# EAGLE board alpha (EAGLE 6.4)
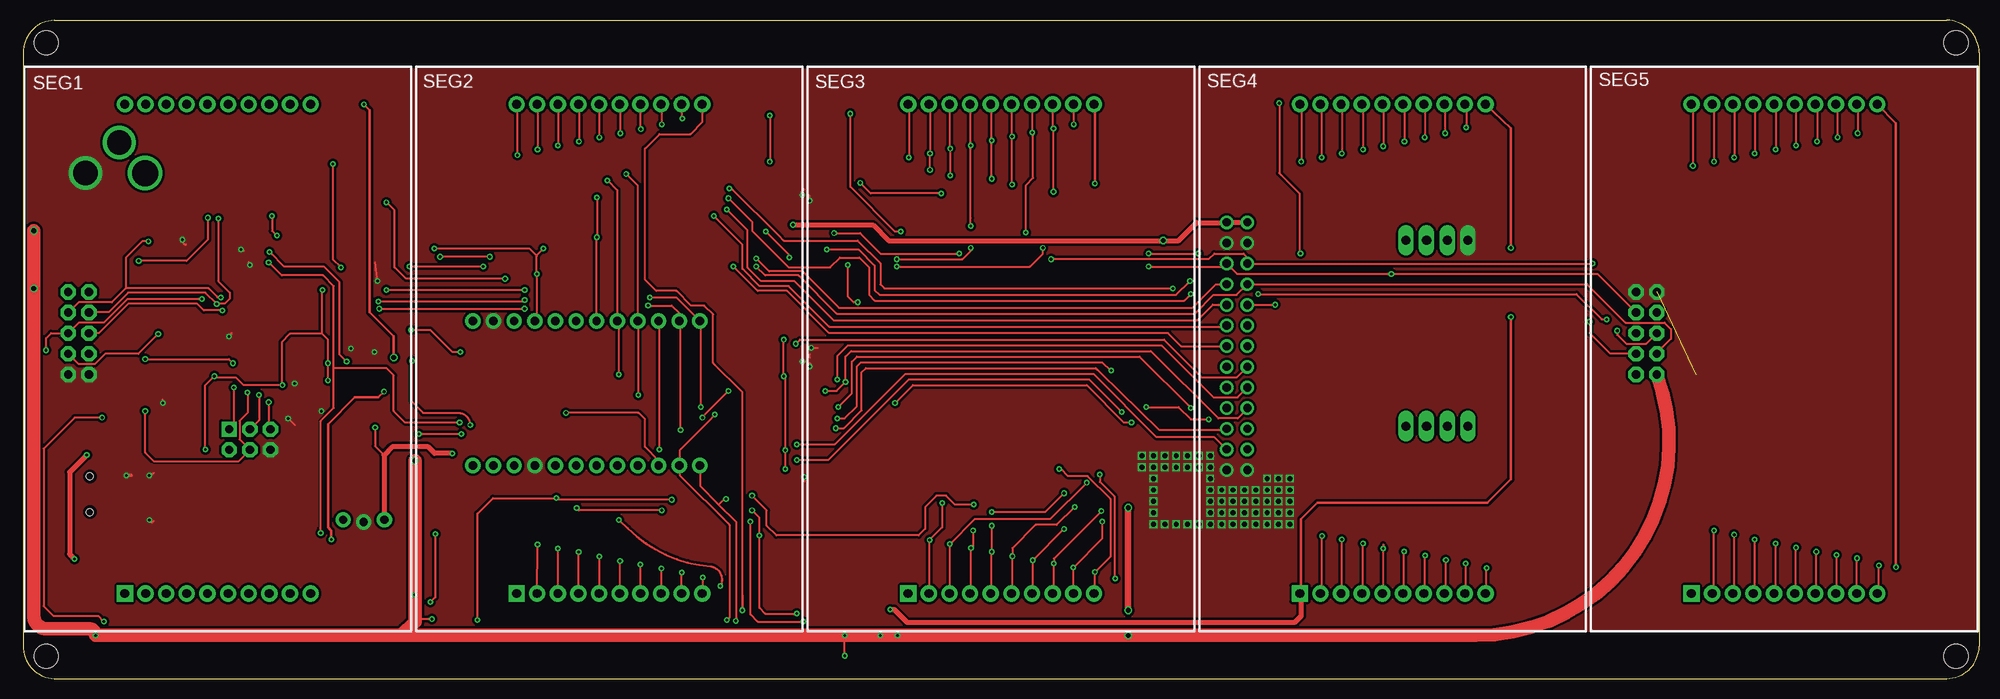
[diagram p1: board, top side]
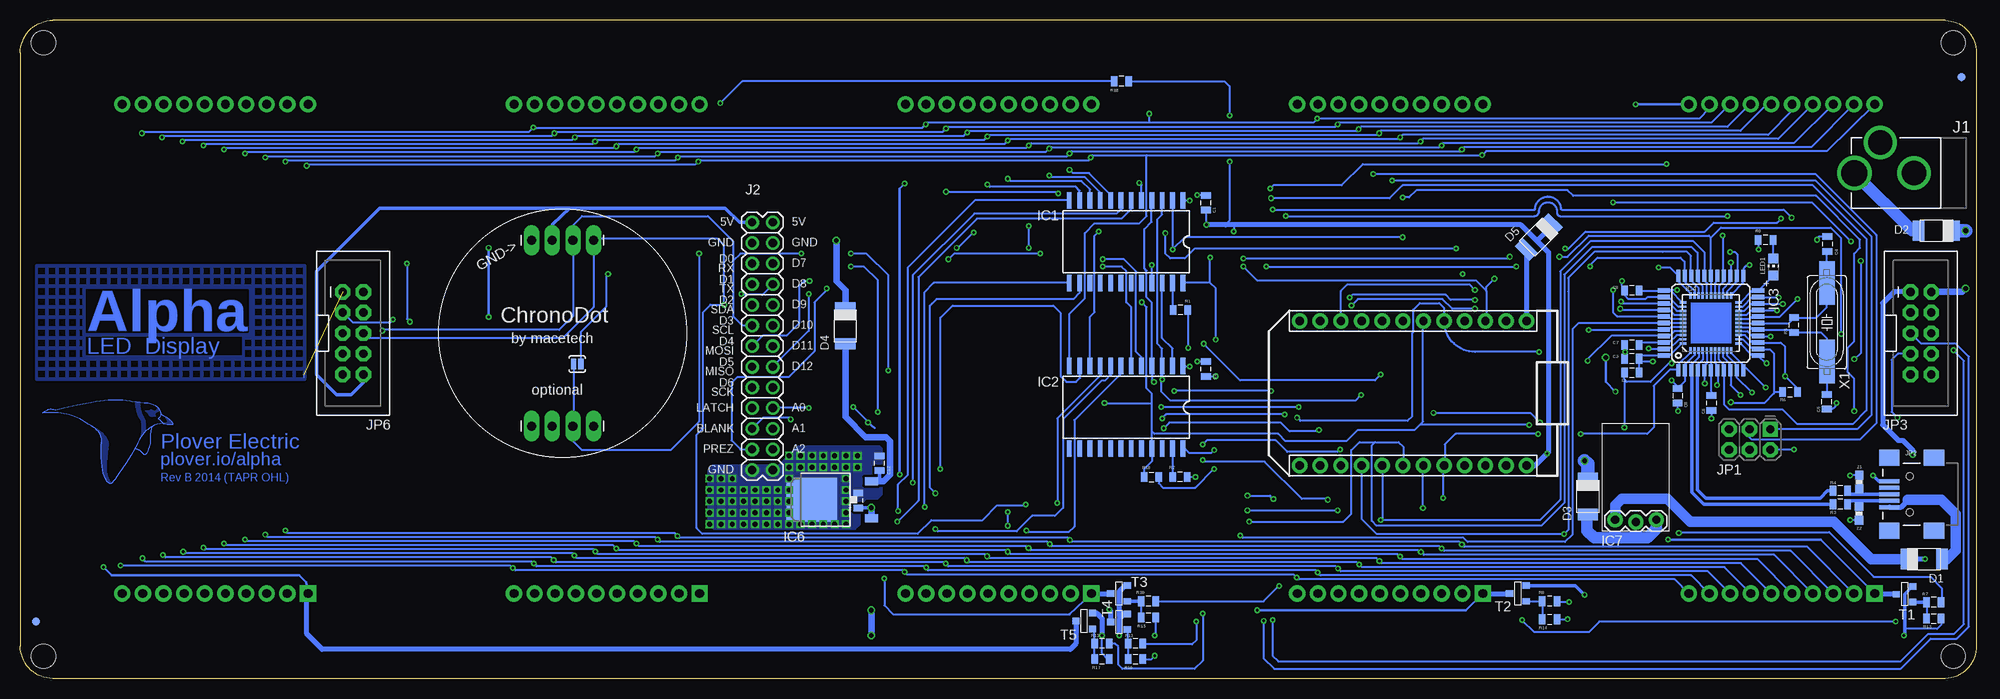
[diagram p2: board, bottom side, seen from below]

Size 240.75 x 81 mm. Coordinates in mm from the lower left corner, seen from the top.
Outline: 3.8,0 236.75,0 arc90 240.75,4 240.75,77 arc90 236.75,81 3.8,81 arc90 0,77 0,4 arc90 3.8,0
Copper layers (1*16): Top 0.0356mm / dielectric 1.5011mm / Bottom 0.0356mm
Design rules "OSHPark *": minimum track width 6mil, minimum drill 13mil, track to track 6mil, track to pad 6mil, pad to pad 6mil, via to via 6mil, smd to smd 6mil, copper to edge 15mil, drill to drill 6mil, minimum pad ring 7mil, minimum via ring 7mil, stop-mask expansion 3mil, vias tented up to drill 15mil, thermal gap 10mil
Holes 3 mm at 2.8,78.25 237.9,78.25 237.9,2.75 2.8,2.75

## Footprints (pad centres in the part's own frame; a part is rotated, then mirrored left to right if it is on the bottom)
0805 = smd 0.8 x 1.2: 1 -0.9,0; 2 0.9,0
SPARK_CORE = drill 1.016 pad 1.88: 1 -8.89,13.97; 2 -8.89,11.43; 3 -8.89,8.89; 4 -8.89,6.35; 5 -8.89,3.81; 6 -8.89,1.27; 7 -8.89,-1.27; 8 -8.89,-3.81; 9 -8.89,-6.35; 10 -8.89,-8.89; 11 -8.89,-11.43; 12 -8.89,-13.97; 13 8.89,-13.97; 14 8.89,-11.43; 15 8.89,-8.89; 16 8.89,-6.35; 17 8.89,-3.81; 18 8.89,-1.27; 19 8.89,1.27; 20 8.89,3.81; 21 8.89,6.35; 22 8.89,8.89; 23 8.89,11.43; 24 8.89,13.97
SOD-128 = smd 1.4 x 2.5: A -2.2,0; C 2.2,0
SO-24DW = smd 0.584 x 2.032: 1 -6.35,-5.08; 2 -5.08,-5.08; 3 -3.81,-5.08; 4 -2.54,-5.08; 5 -1.27,-5.08; 6 0,-5.08; 7 1.27,-5.08; 8 2.54,-5.08; 9 3.81,-5.08; 10 5.08,-5.08; 11 6.35,-5.08; 12 7.62,-5.08; 13 7.62,5.08; 14 6.35,5.08; 15 5.08,5.08; 16 3.81,5.08; 17 2.54,5.08; 18 1.27,5.08; 19 0,5.08; 20 -1.27,5.08; 21 -2.54,5.08; 22 -3.81,5.08; 23 -5.08,5.08; 24 -6.35,5.08
QFN-44 = smd 0.8 x 0.3: 1 -3.4,2.5; 2 -3.4,2; 3 -3.4,1.5; 4 -3.4,1; 5 -3.4,0.5; 6 -3.4,0; 7 -3.4,-0.5; 8 -3.4,-1; 9 -3.4,-1.5; 10 -3.4,-2; 11 -3.4,-2.5; 23 3.4,-2.5; 24 3.4,-2; 25 3.4,-1.5; 26 3.4,-1; 27 3.4,-0.5; 28 3.4,0; 29 3.4,0.5; 30 3.4,1; 31 3.4,1.5; 32 3.4,2; 33 3.4,2.5 | smd 0.3 x 0.8: 12 -2.5,-3.4; 13 -2,-3.4; 14 -1.5,-3.4; 15 -1,-3.4; 16 -0.5,-3.4; 17 0,-3.4; 18 0.5,-3.4; 19 1,-3.4; 20 1.5,-3.4; 21 2,-3.4; 22 2.5,-3.4; 34 2.5,3.4; 35 2,3.4; 36 1.5,3.4; 37 1,3.4; 38 0.5,3.4; 39 0,3.4; 40 -0.5,3.4; 41 -1,3.4; 42 -1.5,3.4; 43 -2,3.4; 44 -2.5,3.4
TQFP44 = smd 1.5 x 0.5: 1 -5.8,4; 2 -5.8,3.2; 3 -5.8,2.4; 4 -5.8,1.6; 5 -5.8,0.8; 6 -5.8,0; 7 -5.8,-0.8; 8 -5.8,-1.6; 9 -5.8,-2.4; 10 -5.8,-3.2; 11 -5.8,-4; 23 5.8,-4; 24 5.8,-3.2; 25 5.8,-2.4; 26 5.8,-1.6; 27 5.8,-0.8; 28 5.8,0; 29 5.8,0.8; 30 5.8,1.6; 31 5.8,2.4; 32 5.8,3.2; 33 5.8,4 | smd 0.5 x 1.5: 12 -4,-5.8; 13 -3.2,-5.8; 14 -2.4,-5.8; 15 -1.6,-5.8; 16 -0.8,-5.8; 17 0,-5.8; 18 0.8,-5.8; 19 1.6,-5.8; 20 2.4,-5.8; 21 3.2,-5.8; 22 4,-5.8; 34 4,5.8; 35 3.2,5.8; 36 2.4,5.8; 37 1.6,5.8; 38 0.8,5.8; 39 0,5.8; 40 -0.8,5.8; 41 -1.6,5.8; 42 -2.4,5.8; 43 -3.2,5.8; 44 -4,5.8
CHRONODOT = drill 1.118 pad 1.88 long: 1 -3.81,11.43; 2 -1.27,11.43; 3 1.27,11.43; 4 3.81,11.43; 5 -3.81,-11.43; 6 -1.27,-11.43; 7 1.27,-11.43; 8 3.81,-11.43
TO252 = smd 1 x 1.6: 1 -2.28,-4.8; 2 2.28,-4.8 | smd 5.4 x 6.2: 3 0,2.5
1X03_LOCK = drill 1.016 pad 1.88: 1 -2.54,0.127; 2 0,-0.127; 3 2.54,0.127
POWER_JACK_PTH_LOCK = drill 2.997 pad 4.115: GND 0.025,6.557; GNDBREAK 3.762,10.7 | drill 3.2 pad 4.115: PWR 0,13.878
2X13 = drill 1.016 pad 1.651: 1 -15.24,-1.27; 2 -15.24,1.27; 3 -12.7,-1.27; 4 -12.7,1.27; 5 -10.16,-1.27; 6 -10.16,1.27; 7 -7.62,-1.27; 8 -7.62,1.27; 9 -5.08,-1.27; 10 -5.08,1.27; 11 -2.54,-1.27; 12 -2.54,1.27; 13 0,-1.27; 14 0,1.27; 15 2.54,-1.27; 16 2.54,1.27; 17 5.08,-1.27; 18 5.08,1.27; 19 7.62,-1.27; 20 7.62,1.27; 21 10.16,-1.27; 22 10.16,1.27; 23 12.7,-1.27; 24 12.7,1.27; 25 15.24,-1.27; 26 15.24,1.27
2X3-NS = drill 1.016 pad 1.88 square: 1 -2.54,-1.27 | drill 1.016 pad 1.88 octagon: 2 -2.54,1.27; 3 0,-1.27; 4 0,1.27; 5 2.54,-1.27; 6 2.54,1.27
USB-MINIB = smd 2.5 x 0.5: D+ 2.5,0; D- 2.5,0.8; GND 2.5,-1.6; ID 2.5,-0.8; VBUS 2.5,1.6 | smd 2.5 x 2: MTN1 -3,4.5; MTN2 2.5,4.5; MTN3 -3,-4.5; MTN4 2.5,-4.5 | hole 0.9: 0,2.2; 0,-2.2
2X5-SHROUDED = drill 1.016 pad 1.88 octagon: 1 -1.27,5.08; 2 1.27,5.08; 3 -1.27,2.54; 4 1.27,2.54; 5 -1.27,0; 6 1.27,0; 7 -1.27,-2.54; 8 1.27,-2.54; 9 -1.27,-5.08; 10 1.27,-5.08
CHIP-LED0805 = smd 1.2 x 1.2: A 0,-1.05; C 0,1.05
BL-S230X-12 = drill 1.1 pad 2 square: 1 -11.43,-30.1 | drill 1.1 pad 2: 2 -8.89,-30.1; 3 -6.35,-30.1; 4 -3.81,-30.1; 5 -1.27,-30.1; 6 1.27,-30.1; 7 3.81,-30.1; 8 6.35,-30.1; 9 8.89,-30.1; 10 11.43,-30.1; 11 11.43,30.1; 12 8.89,30.1; 13 6.35,30.1; 14 3.81,30.1; 15 1.27,30.1; 16 -1.27,30.1; 17 -3.81,30.1; 18 -6.35,30.1; 19 -8.89,30.1; 20 -11.43,30.1
SJ_2S-NO = smd 0.635 x 1.27: 1 -0.45,0; 2 0.45,0
SOT-23 = smd 0.787 x 0.889: 1 0.025,-1.016; 2 -0.94,1.016; 3 0.991,1.016
FIDUCIAL_1MM = smd 1 x 1: 1 0,0
HC49 = smd 5.334 x 1.93: 1 -4.786,-0.04; 2 4.866,-0.04
0603-RES = smd 1.1 x 1: 1 -0.85,0; 2 0.85,0

## Placement (x,y rotation side)
C1  0.1uF  [0805]  94.8,58.55 90 bottom
C2  0.1uF  [0805]  94.8,38.09 90 bottom
C3  1uF  [0805]  42.4,39.35 180 bottom
C4  22pF  [0805]  18.32,53.47 270 bottom
C5  22pF  [0805]  18.37,34.05 90 bottom
C6  1uF  [0805]  32.6,33.9 270 bottom
C7  0.1uF  [0805]  42.4,41.05 180 bottom
C8  0.1uF  [0805]  36.75,34.8 270 bottom
C9  0.1uF  [0805]  42.4,47.75 180 bottom
C11  0.1uF  [0805]  137.6,21.9 90 bottom
C12  0.1uF  [0805]  135,26.5 90 bottom
CORE  Spark Core  [SPARK_CORE]  69.3,35.1 270 bottom
D1  PMEG3030EP  [SOD-128]  6.4,14.7 180 bottom
D2  PMEG3030EP  [SOD-128]  4.9,55.1 0 bottom
D3  PMEG3030EP  [SOD-128]  47.8,22.4 90 bottom
D4  PMEG3030EP  [SOD-128]  139.2,43.4 90 bottom
D5  PMEG3030EP  [SOD-128]  53.84,54.35 45 bottom
IC1  STP16CP05 / STP16CPC26  [SO-24DW]  104,53.76 180 bottom
IC2  STP16CP05 / STP16CPC26  [SO-24DW]  104,33.36 180 bottom
IC3  ATMEGA32U4QFN  [QFN-44]  32.65,43.75 90 bottom
IC4  ATMEGA32U4TQFP-44  [TQFP44]  32.65,43.75 90 bottom
IC5  CHRONODOT  [CHRONODOT]  174,42.5 0 bottom
IC6  7805DT  [TO252]  140.8,22 90 bottom
IC7  Pololu Step-Up  [1X03_LOCK]  41.9,19.4 0 bottom
J1  POWER_JACKPTH_LOCK  [POWER_JACK_PTH_LOCK]  1.1,62.2 90 bottom
J2  ACCESSORY  [2X13]  149.4,40.9 270 bottom
JP1  ICSP  [2X3-NS]  27.88,29.41 180 bottom
JP2  USBSMD  [USB-MINIB]  8.19,22.68 180 bottom
JP3  M05X2SHD  [2X5-SHROUDED]  6.8,42.5 0 bottom
JP6  M05X2SHD  [2X5-SHROUDED]  199.8,42.5 0 bottom
L1  FERRITE0805  [0805]  42.4,37.65 0 bottom
LED1  DEBUG  [CHIP-LED0805]  24.96,50.64 0 bottom
R1  390R  [0805]  97.95,45.35 180 bottom
R2  910R  [0805]  98,24.8 180 bottom
R3  22R  [0805]  16.7,21.45 180 bottom
R4  22R  [0805]  16.7,23.1 180 bottom
R5  1M  [0805]  22.4,43.5 90 bottom
R6  10k  [0805]  22.9,35.25 0 bottom
R7  910R  [0805]  5.2,9.4 180 bottom
R8  910R  [0805]  25.92,53.98 180 bottom
R9  910R  [0805]  52.5,9.5 180 bottom
R10  910R  [0805]  101.9,9.5 180 bottom
R11  910R  [0805]  103.5,4.3 180 bottom
R12  910R  [0805]  107.6,4.3 180 bottom
R13  910R  [0805]  5.2,7.4 0 bottom
R14  910R  [0805]  52.5,7.3 0 bottom
R15  910R  [0805]  101.9,7.5 0 bottom
R16  910R  [0805]  103.5,2.4 0 bottom
R17  910R  [0805]  107.6,2.4 0 bottom
R18  10k  [0805]  105.2,73.5 180 bottom
R19  10k  [0805]  101.5,24.8 0 bottom
SEG1  BL-S230X-12  [BL-S230X-12]  23.93,40.56 0 top
SEG2  BL-S230X-12  [BL-S230X-12]  72.14,40.56 0 top
SEG3  BL-S230X-12  [BL-S230X-12]  120.35,40.56 0 top
SEG4  BL-S230X-12  [BL-S230X-12]  168.56,40.56 0 top
SEG5  BL-S230X-12  [BL-S230X-12]  216.77,40.56 0 top
SJ1  SQW  [SJ_2S-NO]  172.2,38.7 180 bottom
T1  [SOT-23]  8.8,10.4 270 bottom
T2  [SOT-23]  56.4,10.5 270 bottom
T3  [SOT-23]  105.5,10.5 270 bottom
T4  [SOT-23]  105.5,7 270 bottom
T5  [SOT-23]  109.8,7.1 270 bottom
U$1  FIDUCIAL  [FIDUCIAL_1MM]  1.8,74 0 bottom
U$2  FIDUCIAL  [FIDUCIAL_1MM]  238.8,7 0 bottom
X1  CRYSTALHC49  [HC49]  18.41,43.79 90 bottom
Z1  [0603-RES]  14.4,24.18 270 bottom
Z2  [0603-RES]  14.41,20.32 90 bottom

## Tracks (layer width: path | path; a pad name or v marks a point on that pad's centre or on a via)
A0  (via drill 0.33)
  Top 0.254: v83.4,33.4 83.4,43.86 CORE.12 80.36,46.9 v77.1,46.9 | v43.7,46.4 61.5,46.4 v61.7,46.6 | v100.3,33.4 102,35.1 102,39 102.6,39.6 137.4,39.6 v143.7,33.3
  Bottom 0.254: IC3.36 36.85,45.25 37.7,46.1 38.4,46.1 IC4.36 43.45,46.15 v43.7,46.4 | v61.7,46.6 64.7,46.6 65.3,47.2 76.8,47.2 v77.1,46.9 | v83.4,33.4 v100.3,33.4 | v143.7,33.3 148.11,33.3 J2.20
A1  (via drill 0.33)
  Top 0.254: v80.9,30.6 80.9,43.82 | 81,43.72 80.9,43.82 | 80.9,43.82 CORE.11 | v43.8,45.5 v61.7,45.5 | v76.9,45.9 79.8,45.9 80.7,45 80.7,44.02 CORE.11 | v100,30.8 101,30.8 103.2,33 103.2,37.7 103.7,38.2 132.02,38.2 132.61,37.61 | 132,38.2 132.61,37.61 | 132.61,37.61 139.8,30.6 147.99,30.6 J2.22 | 80.9,43.82 CORE.11
  Bottom 0.254: IC3.37 37.15,44.75 37.7,45.3 38.4,45.3 IC4.37 43.65,45.35 v43.8,45.5 | v80.9,30.6 81.1,30.4 84.5,30.4 85.6,31.5 99.3,31.5 v100,30.8 | v61.7,45.5 64.5,45.5 65.7,46.7 76.1,46.7 v76.9,45.9
A2  (via drill 0.33)
  Top 0.254: v78.3,28.2 78.3,43.88 CORE.10 | v61.7,47.8 v44.7,47.8 | v95.2,28.8 99.9,28.8 108.6,37.5 131.7,37.5 139.5,29.7 146.6,29.7 148.1,28.2 J2.24
  Bottom 0.254: IC3.38 37.55,44.25 37.8,44.5 38.4,44.5 IC4.38 38.5,44.6 44.2,44.6 44.7,45.1 v44.7,47.8 | v78.3,28.2 78.6,27.9 84.8,27.9 86.2,29.3 94.7,29.3 v95.2,28.8 | CORE.10 78.19,47.71 77.4,48.5 62.4,48.5 v61.7,47.8
AREF
  Bottom 0.254: IC3.42 36.85,42.25 37.8,41.3 38.4,41.3 IC4.42 41.2,41.35 arc-90 C7.1
AVCC  (via drill 0.33)
  Top 0.254: v30.3,52.5 32.1,50.7 37,50.7 38.9,48.8 38.9,39.9 v39.8,39
  Bottom 0.254: IC3.24 30.65,47.65 29.5,48.8 29.5,49.1 29.5,49.5 IC4.24 29.4,49.6 29.4,52.2 29.7,52.5 v30.3,52.5 | IC3.44 36.25,41.25 37.7,39.8 38.4,39.8 IC4.44 39,39.75 | 39,39.75 41.1,39.75 arc-90 C3.1 | 38.9,39.65 39,39.75 | C3.1 L1.2 | v39.8,39 41.15,39 C3.1
BIRD1
  Bottom 0.1: 224.11,31.2 224.1,31.2
  Bottom 0.152: 223.47,32.56 223.47,32.54 223.49,32.41 223.53,32.27 223.57,32.18 223.63,32.09 223.71,32.02 223.76,31.99 223.67,31.9 223.42,31.63 223.3,31.52 223.19,31.43 223.12,31.39 223.07,31.37 223.05,31.37 | 224.09,31.21 224.1,31.2 224.24,31.16 224.41,31.09 224.56,31.01 224.72,30.91 224.9,30.79 225.09,30.64 225.29,30.46 225.5,30.25 225.71,29.99 225.91,29.7 226.12,29.37 226.31,28.99 226.5,28.57 226.58,28.33 | 237.99,32.73 237.94,32.75 237.71,32.87 237.49,33 237.37,33.08 237.3,33.12 237.19,33.17 237.08,33.19 236.97,33.19 236.8,33.16 236.61,33.12 236.45,33.1 236.37,33.09 235.42,33.31 233.76,33.68 232.69,33.9 232.05,34.02 231.46,34.12 230.91,34.2 230.4,34.26 229.91,34.3 229.45,34.32 229.01,34.33 228.57,34.31 228.14,34.28 227.7,34.24 227.24,34.18 227.01,34.14 226.41,34.07 225.49,33.96 225.34,33.95 225.03,33.91 224.79,33.86 224.63,33.81 224.47,33.76 224.32,33.7 224.17,33.62 224.03,33.53 223.9,33.42 223.78,33.3 223.67,33.16 223.59,33.01 223.52,32.83 223.47,32.64 223.45,32.53 223.39,32.5 223.1,32.36 222.84,32.21 222.57,32.02 222.37,31.87 222.25,31.76 222.15,31.64 222.07,31.53 222.02,31.41 222,31.32 221.99,31.25 221.99,31.22 222.02,31.22 222.23,31.21 222.48,31.22 222.68,31.25 222.89,31.3 223.1,31.37 223.21,31.42 223.26,31.41 223.56,31.35 223.88,31.27 224.11,31.2 224.32,31.12 224.46,31.05 224.54,31.01 224.57,30.98 224.61,30.77 224.73,30 224.77,29.59 224.78,29.37 224.78,29.28 224.77,29.21 224.77,29.07 224.79,28.92 224.81,28.76 224.87,28.52 224.98,28.2 225.07,27.98 225.13,27.85 225.2,27.74 225.27,27.65 225.33,27.57 225.39,27.53 225.45,27.51 225.49,27.52 225.51,27.54 225.52,27.55 225.59,27.64 225.72,27.78 225.84,27.9 225.95,27.99 226.06,28.06 226.15,28.12 226.26,28.17 226.39,28.21 226.47,28.24 226.52,28.27 226.53,28.3 226.54,28.34 226.54,28.41 226.54,28.45 226.66,28.25 227.17,27.41 227.66,26.62 228.21,25.79 228.61,25.19 228.86,24.83 229.1,24.52 229.3,24.26 229.44,24.12 229.51,24.05 229.58,24 229.63,23.98 229.65,23.98 229.67,23.97 229.72,23.98 229.8,24.01 229.88,24.07 229.98,24.16 230.09,24.28 230.2,24.45 230.31,24.67 230.42,24.93 230.53,25.26 230.62,25.64 230.69,26.09 230.75,26.61 230.78,27.2 230.79,27.88 230.76,28.64 230.74,29.05 230.73,29.12 230.72,29.25 230.72,29.37 230.73,29.5 230.76,29.67 230.82,29.88 230.91,30.08 231.03,30.26 231.16,30.42 231.31,30.58 231.48,30.72 231.66,30.86 231.96,31.05 232.36,31.29 232.77,31.53 232.97,31.66 233.11,31.76 233.41,31.94 233.72,32.1 234.05,32.24 234.38,32.35 234.71,32.45 235.05,32.53 235.38,32.59 235.72,32.64 236.06,32.68 236.54,32.71 237.16,32.73 237.73,32.73 237.99,32.73
  pour Bottom (no thermals): 226.62,34.05 226.62,34 226.59,33.73 226.56,33.47 226.51,33.16 226.43,32.84 226.35,32.59 226.29,32.43 226.22,32.28 226.14,32.15 226.09,32.08 226.04,32.01 225.96,31.85 225.9,31.67 225.85,31.48 225.82,31.29 225.8,31.1 225.79,30.9 225.79,30.71 225.81,30.43 225.84,30.11 225.9,29.79 225.91,29.72 225.36,30.4 225.24,30.5 225.32,30.82 225.32,31.06 225.33,31.33 225.36,31.62 225.4,31.83 225.44,31.96 225.49,32.08 225.55,32.19 225.58,32.24 225.62,32.3 225.7,32.43 225.77,32.56 225.83,32.71 225.9,32.93 225.96,33.21 225.99,33.48 226.01,33.71 226.01,33.94 226.01,33.99
  pour Bottom: 232.53,31.39 232.41,31.34 231.91,31.08 231.57,30.89 231.32,30.73 231.08,30.56 230.84,30.36 230.61,30.16 230.4,29.93 230.26,29.76 230.18,29.63 230.11,29.51 230.05,29.38 230,29.25 229.96,29.11 229.94,28.97 229.93,28.83 229.93,28.76 230.05,27.76 230.16,26.61 230.19,26.15 230.19,25.88 230.19,25.63 230.17,25.4 230.13,25.19 230.08,24.98 230.01,24.78 229.93,24.58 229.82,24.37 229.7,24.16 229.63,24.05 229.71,24.1 229.85,24.23 229.98,24.38 230.11,24.56 230.23,24.77 230.33,25.01 230.43,25.28 230.52,25.59 230.59,25.93 230.66,26.31 230.71,26.73 230.74,27.18 230.77,27.68 230.77,28.22 230.77,28.8 230.74,29.42 230.72,29.75 230.72,29.79 230.73,29.86 230.74,29.93 230.77,30 230.82,30.1 230.92,30.24 231.05,30.38 231.19,30.52 231.35,30.65 231.52,30.78 231.78,30.96 232.1,31.15 232.45,31.34
  pour Bottom: 223.22,31.55 223.18,31.54 223,31.5 222.86,31.5 222.75,31.5 222.69,31.52 222.64,31.55 222.61,31.59 222.6,31.65 222.61,31.72 222.64,31.81 222.71,31.92 222.76,31.98 222.8,32.04 222.86,32.13 222.87,32.17 222.87,32.18 222.85,32.19 222.8,32.17 222.73,32.13 222.59,32.02 222.37,31.83 222.21,31.68 222.12,31.57 222.05,31.47 222,31.39 221.98,31.33 221.98,31.3 221.98,31.28 222,31.26 222.01,31.25 222.04,31.24 222.11,31.22 222.25,31.21 222.46,31.22 222.68,31.25 222.89,31.3 223.07,31.37 223.17,31.42 223.21,31.46 223.24,31.49 223.23,31.53
  pour Bottom: 223.9,33.43 223.9,33.38 223.91,33.27 223.93,33.16 223.98,33.06 224.03,32.98 224.09,32.94 224.13,32.92 224.17,32.9 224.22,32.9 224.28,32.9 224.33,32.92 224.36,32.93 224.37,32.94 224.44,32.97 224.5,32.99 224.58,33 224.67,33 224.77,32.98 224.88,32.94 224.93,32.9 225.38,32.94 225.04,32.69 225.03,32.67 225.03,32.65 225,32.56 224.96,32.48 224.9,32.4 224.84,32.35 224.78,32.32 224.72,32.3 224.65,32.29 224.57,32.29 224.47,32.3 224.42,32.31 224.06,32.28 224.07,32.3 224.11,32.41 224.13,32.54 224.13,32.62 224.12,32.68 224.1,32.71 224.07,32.74 224.04,32.77 224.01,32.78 224,32.78 223.88,32.83 223.77,32.89 223.7,32.94 223.65,33 223.63,33.05 223.63,33.08 223.63,33.1
BLANK  (via drill 0.33)
  Top 0.254: v47.8,39.1 47.8,34.1 49.2,32.7 53.5,32.7 arc-90 v55,31.2 | v102.7,46.3 102.2,46.3 101.5,47 v101.5,50.9 | v136.4,31.5 135.5,31.5 130.9,36.1 109.5,36.1 v107.3,33.9 | v138.2,33.4 142.2,33.4 143.7,31.9 v145.9,31.9
  Bottom 0.254: IC3.41 37.15,42.75 37.7,42.2 38.4,42.2 IC4.41 38.5,42.2 44.9,42.2 47.9,39.2 v47.8,39.1 | CORE.6 68.1,43.92 68.1,31.6 68.5,31.2 | 68.5,31.2 69.1,30.6 76.1,30.6 77.5,29.2 85,29.2 85.9,30.1 101.16,30.1 101.46,30.4 | 101.46,30.4 IC2.21 101.4,28.22 101.4,26.8 102.4,25.8 R19.1 | 101.46,30.4 101.46,33.9 | 101.46,33.9 101.46,35.06 102.1,35.7 102.1,45.7 v102.7,46.3 | v101.5,50.9 101.5,48.72 IC1.21 | 150.67,30.93 J2.21 149.31,32.1 146.1,32.1 v145.9,31.9 | v136.4,31.5 135.6,30.8 v138.2,33.4 | v107.3,33.9 101.46,33.9 | v55,31.2 68.5,31.2
COL-A1  (via drill 0.33)
  Top 0.254: SEG3.17 116.54,65.7 v116.6,65.6 116.6,56.7 v116.6,55.7 | v107.5,51.6 115.6,51.6 116.6,52.6 v116.6,53 | SEG2.17 68.4,70.66 v68.4,66.1 | SEG4.17 164.9,70.66 v164.9,65.1 | SEG5.17 213.1,70.66 v213.1,64.6
  Bottom 0.254: SEG1.17 24.38,66.4 68.1,66.4 v68.4,66.1 68.5,66.1 68.7,65.9 116.3,65.9 v116.6,65.6 116.9,65.3 164.7,65.3 v164.9,65.1 165.2,64.8 212.8,64.8 213,64.6 v213.1,64.6 | IC2.5 102.73,39.53 103.4,40.2 103.4,50.1 104.9,51.6 v107.5,51.6 | v116.6,53 v116.6,55.7
COL-A2  (via drill 0.33)
  Top 0.254: SEG3.14 124.16,67.26 v124.2,67.2 124.3,67.1 124.3,61.6 123.4,60.7 v123.4,54.9 | v107.5,50.7 123.9,50.7 125.5,52.3 v125.5,53 | SEG4.14 172.5,70.66 v172.5,66.6 | SEG5.14 220.8,70.66 v220.8,66.1 | v76,67.6 75.95,67.6 SEG2.14
  Bottom 0.254: SEG1.14 27.84,70.66 30.6,67.9 75.7,67.9 v76,67.6 76.2,67.4 124.1,67.4 v124.2,67.2 124.6,66.8 172.3,66.8 v172.5,66.6 172.8,66.3 220.6,66.3 v220.8,66.1 | IC2.6 104,45.7 104.6,46.3 104.6,50.1 105.2,50.7 v107.5,50.7 | v125.5,53 125.3,53 v123.4,54.9
COL-B  (via drill 0.33)
  Top 0.254: v78.6,68.2 78.6,70.6 SEG2.13 | SEG3.13 126.7,69.3 126.7,67.7 v126.8,67.7 126.8,60.7 v126.8,59.9 | v113,59.7 104.3,59.7 v103,61 | SEG4.13 175,70.66 v175,67.1 | SEG5.13 223.3,70.66 v223.3,66.6
  Bottom 0.254: SEG1.13 30.34,70.66 32.6,68.4 78.4,68.4 v78.6,68.2 78.9,67.9 126.6,67.9 v126.8,67.7 127.2,67.3 174.8,67.3 v175,67.1 175.3,66.8 223.1,66.8 v223.3,66.6 | IC1.5 102.73,60.73 v103,61 | v126.8,59.9 113.2,59.9 v113,59.7
COL-C  (via drill 0.33)
  Top 0.254: SEG2.9 81.05,10.49 v81.05,13.05 | SEG3.9 129.25,10.75 v129.25,13.65 132.8,17.2 v132.8,19.3 | SEG4.9 177.55,11.11 v177.55,14.15 177.5,14.2 | SEG5.9 225.7,10.46 v225.7,14.8
  Bottom 0.254: SEG1.9 35.06,12.7 80.7,12.7 v81.05,13.05 81.3,13.3 129,13.3 v129.25,13.65 129.4,13.8 177.2,13.8 v177.55,14.15 177.8,14.4 225.3,14.4 v225.7,14.8 | IC1.6 104,57.8 105.2,56.6 123,56.6 130.2,49.4 130.2,21.9 v132.8,19.3
COL-D1  (via drill 0.33)
  Top 0.254: SEG3.4 116.65,10.75 v116.65,16.05 116.9,16.3 v116.9,18.2 | SEG2.4 68.35,10.49 v68.35,15.55 | SEG5.4 213.1,10.46 v213.1,17.1 | SEG4.4 164.9,10.46 v164.9,16.6
  Bottom 0.254: SEG1.4 24.86,15.2 68,15.2 v68.35,15.55 68.55,15.75 68.7,15.8 116.4,15.8 v116.65,16.05 116.9,16.3 164.6,16.3 v164.9,16.6 165.2,16.9 212.9,16.9 v213.1,17.1 | IC2.7 105.27,37.53 111,31.8 111,18.7 111.7,18 116.7,18 v116.9,18.2
COL-D2  (via drill 0.33)
  Top 0.254: SEG2.7 75.95,10.51 v75.95,14.05 | SEG3.7 124.25,11.07 v124.25,14.55 v128.1,18.4 | SEG4.7 172.55,10.63 v172.55,15.15 172.5,15.2 | SEG5.7 220.7,10.46 v220.7,15.6
  Bottom 0.254: SEG1.7 30.98,13.7 75.6,13.7 v75.95,14.05 76.2,14.3 124,14.3 v124.25,14.55 124.5,14.8 172.2,14.8 v172.55,15.15 172.8,15.4 220.5,15.4 v220.7,15.6 | IC2.8 106.54,37.36 107.2,36.7 107.6,36.7 112.4,31.9 112.4,21 113.4,20 116.2,20 118.1,18.1 127.8,18.1 v128.1,18.4
COL-DP  (via drill 0.33)
  Top 0.254: SEG3.10 131.9,10.78 v131.9,13.1 133.8,15 133.8,22.1 131,24.9 128.6,24.9 127.7,25.8 v127.5,25.8 | SEG4.10 180.1,10.82 v180.1,13.6 | v83.65,12.45 83.65,10.89 83.6,10.54 83.62,10.52 SEG2.10 | SEG5.10 228.4,10.46 v228.4,13.9
  Bottom 0.254: SEG1.10 37.1,12.2 83.4,12.2 v83.65,12.45 84,12.8 131.6,12.8 v131.9,13.1 132.1,13.3 179.8,13.3 v180.1,13.6 180.4,13.9 v228.4,13.9 | IC2.11 110.3,38.39 110.3,37 110.8,36.5 112,36.5 112.7,37.2 112.7,45 113.6,45.9 126,45.9 127.5,44.4 127.5,29 127.5,28.6 v127.5,25.8
COL-DP2  (via drill 0.33)
  Top 0.254: SEG3.20 109,70.64 v109,64.1 | SEG2.20 60.8,70.66 v60.8,64.4 | SEG4.20 157.3,70.66 v157.3,63.6 | SEG5.20 205.5,70.66 v205.5,63.1
  Bottom 0.254: SEG1.20 18.36,64.9 60.3,64.9 v60.8,64.4 102.1,64.4 | 102.1,64.4 108.8,64.4 v109,64.1 109.2,63.8 157,63.8 157.2,63.7 v157.3,63.6 157.6,63.3 205.4,63.3 v205.5,63.1 | IC2.12 111.62,44.88 109.7,46.8 109.7,54.8 108.5,56 103,56 102.1,56.9 102.1,64.4
COL-E  (via drill 0.33)
  Top 0.254: SEG4.3 162.3,11.32 v162.3,17.1 | SEG3.3 114.05,10.81 v114.05,16.55 117.1,19.6 126.4,19.6 v130.9,24.1 | SEG2.3 65.8,10.9 v65.8,16 | SEG5.3 210.6,10.46 v210.6,17.7
  Bottom 0.254: SEG1.3 22.82,15.7 65.5,15.7 v65.8,16 66.1,16.3 113.8,16.3 v114.05,16.55 114.3,16.8 162,16.8 v162.3,17.1 162.6,17.4 210.3,17.4 v210.6,17.7 | v130.9,24.1 130.9,49.6 123.3,57.2 105.8,57.2 105.2,57.8 105.2,58.77 IC1.7
COL-F  (via drill 0.33)
  Top 0.254: SEG3.19 111.6,70.62 v111.6,64.6 v111.6,62.6 | SEG2.19 63.3,70.66 v63.3,65.1 | SEG4.19 159.8,70.66 v159.8,64.1 | SEG5.19 208.1,70.66 v208.1,63.6
  Bottom 0.254: SEG1.19 20.3,65.4 63,65.4 v63.3,65.1 63.4,64.9 111.3,64.9 v111.6,64.6 111.9,64.3 159.6,64.3 v159.8,64.1 160.1,63.8 207.9,63.8 v208.1,63.6 | IC1.8 106.54,59.54 109.2,62.2 111.2,62.2 v111.6,62.6
COL-G1  (via drill 0.33)
  Top 0.254: SEG4.2 159.85,11.03 v159.85,17.55 159.7,17.7 | SEG3.2 111.55,10.77 v111.55,17.05 113.1,18.6 v113.1,21.6 | SEG2.2 v63.3,16.5 | SEG5.2 208.1,10.46 v208.1,18.2
  Bottom 0.254: SEG1.2 20.78,16.2 63,16.2 v63.3,16.5 63.6,16.8 111.3,16.8 v111.55,17.05 111.8,17.3 159.6,17.3 v159.85,17.55 160.2,17.9 207.9,17.9 208.1,18.1 v208.1,18.2 | IC2.9 107.81,37.29 113.1,32 v113.1,21.6
COL-G2  (via drill 0.33)
  Top 0.254: v81.1,68.9 81.1,70.64 SEG2.12 | SEG3.12 129.24,68.34 v129.3,68.2 | v108,55 107.3,55 101.8,60.5 v101.8,69.5 | SEG4.12 177.6,70.66 v177.6,67.8 | SEG5.12 225.8,70.66 v225.8,67.1
  Bottom 0.254: SEG1.12 32.82,70.18 34.1,68.9 v81.1,68.9 81.6,68.4 101.7,68.4 | 101.7,68.4 129.1,68.4 v129.3,68.2 129.7,67.8 v177.6,67.8 178.1,67.3 225.6,67.3 v225.8,67.1 | IC2.10 109.08,44.52 108.5,45.1 108.5,54.5 v108,55 | v101.8,69.5 101.8,68.5 101.7,68.4
COL-H  (via drill 0.33)
  Top 0.254: SEG3.18 114,65.3 v114.1,65.2 v114.1,61.9 | SEG2.18 v65.8,65.6 | SEG4.18 162.3,70.66 v162.3,64.6 | SEG5.18 210.6,70.66 v210.6,64.1
  Bottom 0.254: SEG1.18 22.44,65.9 65.7,65.9 v65.8,65.6 65.9,65.6 66.1,65.4 113.8,65.4 114,65.2 v114.1,65.2 114.5,64.8 162,64.8 162.2,64.6 v162.3,64.6 162.6,64.3 210.4,64.3 v210.6,64.1 | IC1.9 107.81,59.81 109.7,61.7 113.9,61.7 v114.1,61.9
COL-J  (via drill 0.33)
  Top 0.254: v70.9,66.6 70.9,70.64 SEG2.16 | SEG3.16 119.08,66.3 v119.2,66.2 v119.2,61.5 | SEG4.16 167.4,70.66 v167.4,65.5 | SEG5.16 215.7,70.66 v215.7,65.1
  Bottom 0.254: SEG1.16 22.66,69.84 25.6,66.9 70.6,66.9 v70.9,66.6 71.1,66.4 119,66.4 v119.2,66.2 119.6,65.8 167.1,65.8 v167.4,65.5 167.6,65.3 215.5,65.3 v215.7,65.1 | IC1.10 109.08,60.18 110.1,61.2 118.9,61.2 v119.2,61.5
COL-K  (via drill 0.33)
  Top 0.254: v73.5,67.1 73.5,70.62 SEG2.15 | SEG3.15 121.62,66.82 v121.7,66.7 v121.7,60.8 | SEG4.15 170,70.66 v170,66.1 | SEG5.15 218.2,70.66 v218.2,65.6
  Bottom 0.254: SEG1.15 25.74,70.66 29,67.4 73.3,67.4 v73.5,67.1 73.7,66.9 121.5,66.9 v121.7,66.7 122.1,66.3 169.7,66.3 169.9,66.1 v170,66.1 170.3,65.8 218,65.8 v218.2,65.6 | IC1.11 110.35,60.05 110.8,60.5 121.4,60.5 v121.7,60.8
COL-L  (via drill 0.33)
  Top 0.254: SEG4.8 175.1,11.52 v175.1,14.6 175.1,14.7 | SEG3.8 126.85,11.01 v126.85,14.15 126.85,14.75 v132.7,20.6 | SEG2.8 78.55,10.55 v78.55,13.55 | SEG5.8 223.2,10.46 v223.2,15.2
  Bottom 0.254: SEG1.8 33.02,13.2 78.2,13.2 v78.55,13.55 78.8,13.8 126.5,13.8 v126.85,14.15 127,14.3 174.8,14.3 v175.1,14.6 175.4,14.9 222.9,14.9 v223.2,15.2 | IC1.12 123.26,58.84 131.5,50.6 131.5,25.1 132.7,23.9 v132.7,20.6
COL-M  (via drill 0.33)
  Top 0.254: SEG4.6 169.95,10.49 v169.95,15.65 170,15.7 | SEG3.6 121.75,10.93 v121.75,15.05 121.75,16.05 124.6,18.9 127.2,18.9 v129.4,21.1 | SEG2.6 73.45,10.47 v73.45,14.45 | SEG5.6 218.2,10.46 v218.2,16.1
  Bottom 0.254: SEG1.6 28.94,14.2 73.2,14.2 v73.45,14.45 73.8,14.8 121.5,14.8 v121.75,15.05 122,15.3 169.6,15.3 v169.95,15.65 170.2,15.9 218,15.9 v218.2,16.1 | IC1.13 128.32,48.68 129.5,47.5 129.5,21.2 v129.4,21.1
COL-N  (via drill 0.33)
  Top 0.254: SEG4.5 167.4,11 v167.4,16 167.4,16.5 | SEG3.5 119.2,10.84 v119.2,15.6 v119.2,18.8 | SEG2.5 70.9,10.78 v70.9,15 | v119.2,20.5 125.8,20.5 v128.1,22.8 | SEG5.5 215.7,10.46 v215.7,16.6
  Bottom 0.254: SEG1.5 26.9,14.7 70.6,14.7 v70.9,15 71.2,15.3 118.9,15.3 v119.2,15.6 119.4,15.8 167.2,15.8 v167.4,16 167.8,16.4 215.5,16.4 v215.7,16.6 | IC1.14 110.35,47.45 111.1,46.7 128,46.7 128.55,46.15 128.8,45.9 128.8,23.5 v128.1,22.8 | v119.2,18.8 v119.2,20.5
D0/RX  (via drill 0.33)
  Top 0.254: CORE.4 63.2,44.24 v63.2,49.8 63.2,52 | JP3.3 8.13,45.1 10.5,45.1 12.9,47.5 22.4,47.5 v23.8,46.1 23.85,46.15 24.8,46.15 25.4,46.75 25.4,47.5 24,48.9 v24,56.6 | 63.2,52 62.3,52.9 v50.6,52.9 | 63.2,52 63.2,52.1 v64,52.9 | v115.2,52.3 105.5,52.3 103,54.8 v99.8,54.8 | v126.5,51.6 145.9,51.6 146.6,52.3 150.2,52.3 150.7,51.8 150.7,51.09 J2.5 v193.16,51.06 | v192.8,43.9 192.8,42.5 195.3,40 198.49,40 JP6.8
  Bottom 0.254: IC3.20 28.55,45.25 27.7,46.1 26.9,46.1 IC4.20 23.85,46.15 v23.8,46.1 | v50.6,52.9 50.2,52.9 48.1,55 33.4,55 32.3,56.1 24.5,56.1 v24,56.6 | v64,52.9 96.2,52.9 97.4,51.7 99.2,51.7 99.8,52.3 v99.8,54.8 | v115.2,52.3 125.8,52.3 v126.5,51.6 | v193.16,51.06 193.16,44.26 v192.8,43.9
D1/TX  (via drill 0.33)
  Top 0.254: v24.3,46.9 23.9,46.9 22.8,48 12.6,48 | 12.6,48 10.9,46.3 6.79,46.3 JP3.4 | v59.3,49.2 47.1,49.2 45.7,50.6 45.7,57.6 v44.7,58.6 | 12.6,48 12.6,51.8 14.6,53.8 v15.4,53.8 | v90.2,50.7 91.3,49.6 95.4,49.6 100.1,44.9 144.2,44.9 146.5,47.2 149.35,47.2 J2.7 192.48,48.52 197.2,43.8 202,43.8 202.8,43 202.8,41.8 201.07,40.07 JP6.7
  Bottom 0.254: 60.3,47.7 61.6,49 88.5,49 v90.2,50.7 | 60.3,47.7 60.3,44.1 CORE.3 | v24.3,46.9 24.35,46.95 IC4.21 26.9,46.9 27.6,46.9 28.75,45.75 IC3.21 | 60.3,47.7 60.3,48.2 v59.3,49.2 | v44.7,58.6 20.2,58.6 v15.4,53.8
D2/SDA  (via drill 0.33)
  Top 0.254: v24.5,45.3 22.2,45.3 21.4,46.1 12.9,46.1 9.3,42.5 JP3.5 | CORE.13 83.3,26.18 83.3,23.7 85.6,21.4 | 85.6,21.4 87.7,19.3 v87.7,7.1 | J2.9 154.08,45.98 v154.1,46 | v117,21.4 114.7,21.4 113.6,22.5 112.4,22.5 111,21.1 111,18.4 110.2,17.6 92.7,17.6 91.5,18.8 91.5,20.7 v89.7,22.5 | v86.5,22.1 86.3,22.1 85.6,21.4
  Bottom 0.254: IC3.19 28.25,44.75 27.7,45.3 26.9,45.3 IC4.19 24.55,45.35 v24.5,45.3 | v87.7,7.1 87.7,2.5 86.4,1.2 9.3,1.2 5.6,4.9 2.4,4.9 0.9,6.4 0.9,39.6 2.5,41.2 6.77,41.2 JP3.5 | v117,21.4 117.1,21.3 120.5,21.3 122.3,19.5 128.6,19.5 130.3,17.8 156.8,17.8 157.5,18.5 157.5,30 156.7,30.8 156.7,45.1 155.8,46 v154.1,46 154.1,53.3 154.9,54.1 170.02,54.1 IC5.4 170.19,45.71 174,41.9 197.93,41.9 JP6.6 | v89.7,22.5 86.9,22.5 v86.5,22.1
D3/SCL  (via drill 0.33)
  Top 0.254: 80.8,26.28 80.8,28.1 85.1,32.4 v85.1,32.5 | 80.8,26.28 CORE.14 | v22,46.7 12.8,46.7 9.9,43.8 6.83,43.8 JP3.6 3.4,42.5 2.8,41.9 v2.8,40.4 | 80.8,26.28 80.8,25 86.9,18.9 86.9,7.5 v86.6,7.2 | v100.2,32 101.1,32 102.6,33.5 102.6,38.4 103.1,38.9 132.8,38.9 v133.9,37.9 | v138.5,52.3 v144.6,52.3 | v196.2,42.8 196.2,42.3 197.3,41.2 199.77,41.2 JP6.5
  Bottom 0.254: IC3.18 27.85,44.25 27.6,44.5 26.9,44.5 IC4.18 24.15,44.55 v22,46.7 | v86.6,7.2 86.6,2.8 85.9,2.1 9.3,2.1 5.9,5.5 2.7,5.5 1.5,6.7 1.5,39.1 v2.8,40.4 | v85.1,32.5 99.7,32.5 v100.2,32 | v133.9,37.9 133.9,49.6 136.6,52.3 v138.5,52.3 | 153,51.4 153,44.6 151.9,43.5 150.73,43.5 J2.11 | 153,51.4 152.1,52.3 v144.6,52.3 | 153,51.4 153,53.8 156.1,56.9 171.6,56.9 172.73,55.77 IC5.3 172.73,44.57 174.4,42.9 196.1,42.9 v196.2,42.8
D4/MOSI  (via drill 0.33)
  Top 0.254: v27.6,35.2 27.6,32.7 26.6,31.7 26.6,29.42 JP1.4 26.44,26.7 21.6,26.7 16.1,26.7 15,27.8 v15,32.9 | v98.9,52.8 102.8,52.8 104.8,50.8 104.8,47.8 105.4,47.2 141.9,47.2 v143.6,48.9 | CORE.7 70.57,54.27 v70.6,54.3 v70.6,59.2
  Bottom 0.254: 29.5,37.9 29.5,38.6 30.65,39.75 IC3.10 | 29.5,37.9 29.5,37.1 v27.6,35.2 | IC4.10 29.5,37.9 | IC1.2 98.92,52.82 v98.9,52.8 97.4,54.3 v70.6,54.3 | v143.6,48.9 144.3,48.9 144.9,48.3 144.9,43.7 146.4,42.2 149.37,42.2 J2.13 | v15,32.9 15,36.9 15.8,37.7 15.8,40.7 15,41.5 15,52.3 14.3,53 14.3,54 19.7,59.4 49.6,59.4 50.3,60.1 68.9,60.1 69.8,59.2 v70.6,59.2
D5/MISO  (via drill 0.33)
  Top 0.254: v25.9,35.8 25.9,31.24 JP1.1 | v71.9,61.3 73.1,60.1 CORE.8 73.3,43.8 v73.3,37.4 | v95.1,41.2 95.6,41.7 140.4,41.7 145,37.1 149.41,37.1 J2.15
  Bottom 0.254: 28.6,38.5 30.15,40.05 IC3.11 | 28.6,38.5 28.6,38 IC4.11 | 28.6,38.5 v25.9,35.8 | v73.3,37.4 74,36.7 90.6,36.7 v95.1,41.2 | v71.9,61.3 19.8,61.3 12.9,54.4 12.9,32.4 14.6,30.7 25.32,30.7 JP1.1
D6
  Bottom 0.254: IC4.27 31.9,49.5 31.9,48.9 32.15,48.65 IC3.27
D6/SCK  (via drill 0.33)
  Top 0.254: v29,34.9 29,31.8 JP1.3 | v75.7,34.9 75.7,43.94 CORE.9 75.65,60.65 v74.2,62.1 | v100.2,36.8 100.2,39.7 101.5,41 140.1,41 146.5,34.6 149.45,34.6 J2.17
  Bottom 0.254: 30.2,37.9 30.2,38.6 31.15,39.55 IC3.9 | 30.2,37.9 30.2,36.1 v29,34.9 | IC4.9 30.2,37.9 | v75.7,34.9 76.4,34.2 99.2,34.2 100.3,35.3 100.3,38.33 IC2.3 | v74.2,62.1 19.8,62.1 12.3,54.6 12.3,31.4 14.3,29.4 27.6,29.4 27.9,29.7 27.9,30.66 JP1.3 | IC2.3 100.19,40.59 100.8,41.2 100.8,56.5 100.2,57.1 IC1.3 | IC2.3 100.19,37.31 v100.2,36.8
D7  (via drill 0.33)
  Top 0.254: v48.7,30.1 v53.9,30.1 | v79.8,22 65.8,22 v65.6,22.2 57.8,22.2 55.9,20.3 v55.9,7.2 | v95.2,26.9 99.1,26.9 109,36.8 131.2,36.8 v135.2,32.8 | v138.5,50.7 147.77,50.7 J2.6 149.4,49.8 v168.4,49.8 193.77,49.8 JP6.4 | v9.9,7 9.2,7.7 3.7,7.7 2.5,8.9 2.5,28.3 6.3,32.1 v9.7,32.1
  Bottom 0.254: 35.15,40.15 36.7,38.6 36.7,38 | 36.7,38 IC4.1 | 36.7,38 37.7,38 39.7,36 39.7,30.9 40.5,30.1 v48.7,30.1 | v53.9,30.1 64.1,30.1 65.4,28.8 65.4,26.3 CORE.20 65.6,26.1 v65.6,22.2 | v79.8,22 79.9,22.1 83,22.1 87.6,26.7 95,26.7 v95.2,26.9 | v9.9,7 46.4,7 47.7,5.7 54.4,5.7 v55.9,7.2 | v135.2,32.8 135.2,49 136.9,50.7 v138.5,50.7 | SJ1.1 171.75,42.65 168.6,45.8 168.6,49.6 v168.4,49.8 | JP3.7 9.64,39.96 10.4,39.2 10.4,32.8 v9.7,32.1
  Bottom 0.305: 35.15,40.15 IC3.1
D8  (via drill 0.33)
  Top 0.254: v16.6,42.4 14.16,39.96 10.06,39.96 8.8,38.7 6.79,38.7 JP3.8 | v57.4,51.9 v51.3,51.9 | J2.8 146.8,48.5 143.9,45.6 100.4,45.6 95.9,50.1 91.8,50.1 v90.2,51.7 | v152,47.3 191.19,47.3 194.29,44.2 v194.9,44.2
  Bottom 0.254: v16.6,42.4 16.6,54.2 17.9,55.5 31.4,55.5 32.65,54.25 | IC3.28 IC4.28 32.65,54.25 | 57.5,52 v57.4,51.9 57.6,51.7 v90.2,51.7 | v51.3,51.9 50.3,51.9 47.7,54.5 32.9,54.5 32.65,54.25 | J2.8 148.13,48.47 149.4,47.2 151.9,47.2 v152,47.3 | v194.9,44.2 195.3,43.8 199.8,43.8 201.04,45.04 JP6.3
D9  (via drill 0.33)
  Top 0.254: v22.7,56.7 22.7,54 20.1,51.4 v14.2,51.4 | v15,39.3 25.3,39.3 v25.8,38.8 | v86.6,57.7 89.1,55.2 89.1,50.6 90.8,48.9 94.9,48.9 99.7,44.1 144.5,44.1 146.4,46 148.11,46 J2.10
  Bottom 0.254: v22.7,56.7 23.7,57.7 51,57.7 arc90 51.1,57.8 arc-177 54.3,57.7 v86.6,57.7 | v25.8,38.8 25.9,38.8 IC4.12 26.9,39.8 27.6,39.8 29.05,41.25 IC3.12 | v14.2,51.4 14.2,40 v15,39.3
D10  (via drill 0.33)
  Top 0.254: v30.6,56.9 30.6,55.1 v31.2,54.5 | v85,56.9 88.5,53.4 88.5,50.4 90.6,48.3 94.2,48.3 99.2,43.3 147.89,43.3 J2.12
  Bottom 0.254: IC3.26 31.65,48.25 31.1,48.8 31.1,49.5 IC4.26 31.2,49.7 v31.2,54.5 | v85,56.9 54.4,56.9 arc-90 53.8,57.5 arc185 51.6,57.4 arc-88 51.2,56.9 v30.6,56.9
D11  (via drill 0.33)
  Top 0.254: v56.6,50.7 v47.5,50.7 | J2.14 142.5,40.9 140.9,42.5 99.2,42.5 94,47.7 90.4,47.7 v87.4,50.7
  Bottom 0.254: IC3.32 34.65,47.65 35.9,48.9 35.9,49.5 IC4.32 35.9,49.6 35.9,51.3 36.4,51.8 46.6,51.8 47.5,50.9 v47.5,50.7 | v87.4,50.7 v56.6,50.7
D12  (via drill 0.33)
  Top 0.254: v143.7,47.3 142.9,46.5 104.8,46.5 104.1,47.2 104.1,50.6 102.9,51.8 100.5,51.8 99.3,50.6 94.2,50.6 89.7,55.1 89.7,56.2 v86.8,59.1
  Bottom 0.254: IC3.8 31.65,39.25 31.1,38.7 31.1,38 IC4.8 31,37.9 31,33.7 30.4,33.1 23.8,33.1 22,31.3 15.2,31.3 13.5,33 13.5,54.1 20.1,60.7 70.6,60.7 72.2,59.1 v86.8,59.1 | v143.7,47.3 143.7,42.79 J2.16
DEBUG
  Bottom 0.254: IC3.22 29.05,46.25 27.6,47.7 26.9,47.7 IC4.22 26.8,47.75 LED1.A
GATE0  (via drill 0.33)
  Top 0.254: v36.6,17.9 36.6,31.7 38.2,33.3 38.2,38.2 | v30.2,51.2 31.8,49.6 36.9,49.6 38.2,48.3 38.2,38.2 | CORE.15 78.19,26.81 76.5,28.5 76.5,31.9 75.7,32.7 v66.8,32.7 | v53.7,31.5 47,31.5 45.6,32.9 45.6,37.3 44.7,38.2 38.2,38.2
  Bottom 0.254: IC3.25 31.15,47.95 30.3,48.8 30.3,49.5 IC4.25 | 30.3,49.6 IC4.25 | R7.1 4.2,9.5 4.2,11.1 5.6,12.5 12.6,12.5 18.1,18 36.5,18 v36.6,17.9 | v30.2,51.2 30.2,49.6 IC4.25 | v66.8,32.7 54.9,32.7 v53.7,31.5
GATE1  (via drill 0.33)
  Top 0.254: v50.7,17.8 50.7,10 v50.1,9.4
  Bottom 0.254: IC3.31 34.15,48.05 35.1,49 35.1,49.5 | 35.1,49.5 IC4.31 35.1,49.5 | 35.1,49.5 35.1,52 35.6,52.5 38.6,52.5 47,52.5 50.2,49.3 50.2,47.6 50.2,18.3 v50.7,17.8 73.8,17.8 75.65,19.65 CORE.16 | v50.1,9.4 51.5,9.4 R9.1
GATE2  (via drill 0.33)
  Top 0.254: 73.2,19.5 v73.3,19.5 74.4,18.5 arc41 84.6,13.8 arc-109 v85.8,11.4
  Bottom 0.254: IC3.29 33.15,48.65 33.4,48.9 33.4,49.5 | R10.1 87.7,9.5 v85.8,11.4 | 33.4,49.5 33.4,52.4 34.8,53.8 47.5,53.8 51.2,50.1 51.2,22 53.7,19.5 v73.3,19.5 73.11,19.79 CORE.17 | 33.4,49.5 IC4.29
GATE3  (via drill 0.33)
  Top 0.254: v89.5,19.3 89.5,7.9 90.4,7 v96,7
  Bottom 0.254: IC3.30 33.65,48.25 34.2,48.8 34.2,49.5 IC4.30 34.3,49.6 34.3,52.4 35,53.1 47.3,53.1 50.7,49.7 50.7,21.6 53.5,18.8 73.8,18.8 74.4,19.4 74.4,28.7 74,29.1 | v89.5,19.3 77.9,19.3 76.9,20.3 76.9,28.1 75.9,29.1 74,29.1 | 74,29.1 71.1,29.1 70.5,28.5 70.5,26.28 CORE.18 | v96,7 96,4.7 96.5,4.2 102.5,4.2 R11.1
GATE4  (via drill 0.33)
  Top 0.254: v89.7,20.7 90.6,19.8 v90.6,17.6 90.6,8.7 91.3,8 v95.2,8 | v78.6,20.7 68.4,20.7 v68.1,21
  Bottom 0.254: IC3.39 IC4.39 48.95,43.75 49.7,43 49.7,17.7 50.6,16.8 62.6,16.8 63.1,17.3 90.3,17.3 v90.6,17.6 | v89.7,20.7 v78.6,20.7 | v68.1,21 68.1,26.14 CORE.19 | v95.2,8 95.2,2.2 96.2,1.2 105.1,1.2 105.6,1.7 105.6,3.9 106,4.3 R12.1
GND  (via drill 0.33, 0.6)  (1 unrouted)
  Top 0.254: v17.2,33.9 17.2,34.2 arc90 17.1,34.3 | v15.5,25 16.1,25.3 | v15.5,19.5 15.8,19.2 arc90 16,19.4 | v19.6,54 19.6,53.8 arc90 20,53.4 | v26.8,52.8 26.9,52.8 arc-90 27.1,52.6 | v27.9,50.9 27.9,51 arc90 27.7,51.2 | v43.6,48.9 43.3,51.2 | v33.4,36.3 33.5,36.2 | v32.6,32 33.4,31.2 | v36.7,32.9 36.7,32.8 | v40.3,40.6 40.3,40.7 | v25.3,42.1 25.6,42.4 25.6,42.5 | v96.1,24.8 96.1,24.4 arc90 96.2,24.3 | v97,40.7 97.7,40.7 | 96.8,39.5 96.8,39.9 | v96.8,38.4 96.9,38.7 96.8,38.8 | v95.9,39 96.2,39 96.3,39.1 | v96.8,58.8 96.8,59.4 96.7,59.5 | v95.9,59.5 95.8,59.9 96.1,60.2
  Top 0.406: v12.7,25 13.3,25
  Bottom 0.1: 205.9,37.4 205.9,37
  Bottom 0.254: IC3.5 33.15,38.85 33.3,38.7 IC4.5 33.45,36.35 v33.4,36.3 | IC3.23 30.15,47.25 28.7,48.7 28.7,49.5 IC4.23 28.65,50.15 arc90 v27.9,50.9 | IC3.35 36.65,45.75 37.8,46.9 38.4,46.9 IC4.35 40.45,46.95 40.7,46.7 42.8,46.7 43.3,47.2 C9.2 43.55,47.85 v43.6,48.9 | IC3.43 36.55,41.75 37.8,40.5 38.4,40.5 IC4.43 40.25,40.55 v40.3,40.6 | IC3.15 28.15,42.75 27.55,42.15 IC4.15 | C5.1 17.95,33.15 arc-90 v17.2,33.9 | Z1.1 15.47,25.03 arc-90 v15.5,25 | Z2.1 15.43,19.47 arc-90 v15.5,19.5 | C4.1 19.23,54.37 arc-90 v19.6,54 | R8.2 26.82,52.82 arc-90 v26.8,52.8 | C6.2 v32.6,32 | C8.2 36.75,32.95 v36.7,32.9 | C3.2 v43.2,40.2 C7.2 | 26.9,42.2 IC4.15 | IC4.15 26.8,42.1 v25.3,42.1 | R2.1 v96.1,24.8 | R1.1 97.05,40.75 v97,40.7 | IC2.1 96.94,38.44 v96.8,38.4 | C2.2 v95.89,38.99 v95.9,39 | IC1.1 96.84,58.84 v96.8,58.8 | C1.2 95.75,59.45 v95.9,59.5
  Bottom 0.406: JP2.GND 11.98,24.28 v12.7,25
  other vias: 139.1,26 140.5,26 141.9,26 143.3,26 144.7,26 146.1,26 144.7,27.4 143.3,27.4 141.9,27.4 140.5,27.4 139.1,27.4 146.1,27.4 137.7,26 137.7,27.4 146.1,24.6 146.1,23.2 146.1,21.8 146.1,20.4 146.1,19 144.7,19 143.3,19 141.9,19 140.5,19 139.1,19 139.1,20.4 139.1,21.8 139.1,23.2 139.1,24.6 147.5,23.2 148.9,23.2 150.3,23.2 151.7,23.2 153.1,23.2 154.5,23.2 155.9,23.2 147.5,21.8 147.5,20.4 147.5,19 148.9,21.8 148.9,20.4 148.9,19 150.3,21.8 150.3,20.4 150.3,19 151.7,21.8 151.7,20.4 151.7,19 153.1,21.8 153.1,20.4 153.1,19 154.5,21.8 154.5,20.4 154.5,19 155.9,21.8 155.9,20.4 155.9,19 153.1,24.6 154.5,24.6 155.9,24.6
  pour Top: 8.9,26.5 32.9,26.3 32.9,41.3 36.7,41.3 36.7,18.7 8.9,18.9
  pour Top (isolate 0.305, no thermals): 0.4,75 240.8,75 240.8,5.8 0.3,5.8 0.3,74.9
  pour Bottom (isolate 0.305, no thermals): 134.9,28.5 145.1,28.5 147.4,26.2 155.5,26.2 156.1,25.6 156.1,19.1 155.4,18.4 138,18.4 137.4,19 137.4,21.4 136.6,22.2 135.2,22.2 134.7,22.7 134.7,28.3
  pour Bottom (no thermals, hatched): 238.7,50.8 238.7,36.8 205.75,36.8 205.75,50.8
LATCH  (via drill 0.33)
  Top 0.254: v47.7,42.9 50.1,42.9 52.8,40.2 v53.8,40.2 | J2.19 150.67,33.17 149.5,32 147.1,32 138.8,40.3 101.9,40.3 101.2,39.6 v101.2,36.5 100.1,35.4 v98.7,35.4 | v83.6,32.1 83.6,32.2 v86.8,35.4
  Bottom 0.254: IC3.40 37.55,43.25 37.8,43 38.4,43 IC4.40 47.65,42.95 v47.7,42.9 | IC1.4 101.5,58.8 101.5,56.2 102.4,55.3 102.4,50.5 102.1,50.2 102.1,46.9 101.46,46.26 IC2.4 101.46,36.76 v101.2,36.5 | v83.6,32.1 83.2,31.7 70,31.7 69.4,32.3 69.4,42.5 69.3,42.6 69.3,45.4 68.5,46.2 66.1,46.2 65.5,45.6 CORE.5 CORE.5 arc-90 61.7,40.2 v53.8,40.2 | v86.8,35.4 v98.7,35.4
N$1
  Bottom 0.254: IC1.23 98.92,45.42 R1.2
N$2
  Bottom 0.254: IC2.23 98.92,24.82 R2.2
N$3
  Bottom 0.61: JP2.VBUS 9.22,21.08 8.8,21.5 8.7,21.7 8.4,22
  Bottom 1.27: 8.4,22 4.3,22 2.5,20.2 2.5,15.8 3.6,14.7 D1.A
N$4
  Bottom 0.254: Z2.2 14.41,21.79 arc-90 14.5,21.88
  Bottom 0.406: JP2.D- 14.5,21.88 15.77,21.88 R3.1
N$5
  Bottom 0.254: Z1.2 14.4,22.78 arc90 14.5,22.68
  Bottom 0.406: JP2.D+ 14.5,22.68 15.78,22.68 R4.1
N$6
  Bottom 1.422: D2.A 7.88,55.1 J1.PWR
N$7
  Bottom 0.254: LED1.C 24.96,53.92 R8.1
N$8
  Bottom 0.254: T4.3 104.48,4.38 R11.2 R16.1
N$9
  Bottom 0.254: R7.2 R13.1
  Bottom 0.406: T1.3 R7.2
N$10
  Bottom 0.254: T2.3 R9.2 R14.1
N$11
  Bottom 0.254: R10.2 R15.1
  Bottom 0.406: T3.3 R10.2
N$12
  Bottom 0.254: R17.1 R12.2 108.5,6.03 T5.3
N$13
  Bottom 1.422: IC7.3 39.36,18.44 40.5,17.3 47,17.3 47.9,18.2 47.9,20.1 D3.A
N$14  (via drill 0.33)
  Top 0.254: v154.6,70.8 154.6,62.2 157.1,59.7 157.1,52.4 v157.2,52.3
  Bottom 0.254: R18.2 151.9,73.5 v154.6,70.8 | v157.2,52.3 157.2,31.6 160.7,28.1 171.6,28.1 172.8,29.3 172.8,31 IC5.7 172.65,31.15 SJ1.2
N$15
  Bottom 0.61: CORE.1 55.33,52.73 D5.A
N$16
  Bottom 0.406: C12.1 135,24.3 135.98,24.3 IC6.2
  Bottom 0.813: D4.A 139.2,32.2 136.7,29.7 134.2,29.7 133.7,29.2 133.7,25.1 134.5,24.3 135,24.3
PRESENCE  (via drill 0.33)
  Top 0.254: v38.1,63.3 38.1,51.6 v39.1,50.6 | v86.9,60.3 87.2,60.3 93,54.5 93.6,53.9 102.7,53.9 105.5,51.1 105.5,48.5 106,48 v141.5,48
  Bottom 0.254: IC3.33 35.15,47.35 36.6,48.8 36.6,49.5 IC4.33 37.7,50.6 v39.1,50.6 | v38.1,63.3 75.5,63.3 78.1,60.7 86.5,60.7 v86.9,60.3 | v141.5,48 141.5,47.8 143,46.3 143,40.3 146.2,37.1 152.5,37.1 153.2,36.4 153.2,29.3 152.1,28.2 J2.23
ROW0  (via drill 0.33, 0.6)
  Top 0.305: v37.9,17.1 37.9,18.2 37.5,18.6 37.5,31.3 40.8,34.6 43.7,34.6 v44.4,35.3 | v45.6,39.5 45.6,42.1 42.6,45.1 42.6,69.96 v41.9,70.66
  Bottom 0.305: SEG1.1 19.14,17.1 v37.9,17.1 | 41.4,70.66 v41.9,70.66 41.4,70.66 | 41.4,70.66 SEG1.11 | v44.4,35.3 45.6,36.5 v45.6,39.5
  Bottom 0.406: 10.18,10.46 9.9,10.46 T1.1
  Bottom 0.61: SEG1.1 10.18,10.46
ROW1  (via drill 0.33)
  Top 0.254: 83.6,70.64 SEG2.11 83.6,70.63 83.6,68.5 82.1,67 78.3,67 76.5,65.2 76.5,49.1 77.9,47.7 80.4,47.7 82.2,45.9 83.8,45.9 84.9,44.8 84.9,38.8 88.5,35.2 88.5,10.2
  Top 0.305: 83.4,70.44 SEG2.11 | v88.5,8.4 88.5,10.2
  Bottom 0.254: 57.88,10.46 T2.1
  Bottom 0.305: SEG2.1 62.82,8.4 v88.5,8.4
  Bottom 0.61: SEG2.1 57.88,10.46
ROW2  (via drill 0.33)
  Top 0.254: v132.5,25.1 132.5,24.2 134.3,22.4 134.3,12.4 v134.4,12.3
  Top 0.305: v131.9,60.9 131.9,70.64 SEG3.11
  Bottom 0.254: T3.1 106.67,10.47 106.68,10.46 | v134.4,12.3 134.4,9 133.3,7.9 111.58,7.9
  Bottom 0.305: SEG3.1 111.58,7.9 | v132.5,25.1 132.5,60.3 v131.9,60.9
  Bottom 0.61: SEG3.1 106.68,10.46
ROW3  (via drill 0.33)
  Top 0.305: v183.1,44.5 183.1,24.5 180.2,21.6 159.3,21.6 157.28,19.58 157.28,10.46 SEG4.1 | v183.1,53 183.1,67.7 SEG4.11
  Top 0.61: v106.7,8.5 107.2,8.5 108.8,6.9 156.5,6.9 157.3,7.7 157.3,10.44 SEG4.1
  Bottom 0.305: v183.1,44.5 v183.1,53
  Bottom 0.61: T4.1 106.52,8.32 v106.7,8.5
ROW4  (via drill 0.33)
  Top 0.305: v230.5,13.7 230.5,68.36 SEG5.11
  Bottom 0.305: SEG5.1 205.54,11.84 206.4,12.7 229.5,12.7 v230.5,13.7 | 228.9,70.16 SEG5.11
  Bottom 0.61: T5.1 110.82,4.28 111.5,3.6 203.6,3.6 205.5,5.5 205.5,10.42 SEG5.1
RST  (via drill 0.33)
  Top 0.254: v30.2,34 30.2,30.9 JP1.5
  Bottom 0.254: IC3.13 28.75,41.75 27.5,40.5 26.9,40.5 | 26.9,40.5 IC4.13 | 26.9,40.5 25.4,40.5 24.9,40 24.9,35.1 | 24.9,35.1 26.1,33.9 30.1,33.9 v30.2,34 | R6.1 24.75,35.25 24.9,35.1
SDO
  Bottom 0.254: IC2.2 98.92,40.62 100.2,41.9 IC1.22
UCAP
  Bottom 0.254: IC3.6 IC4.6 32.65,35.85 C6.1
USB_D+
  Bottom 0.254: IC3.4 33.65,39.25 34.2,38.7 34.2,38 IC4.4
  Bottom 0.406: R4.2 18.3,23.1 19.2,22.2 33.3,22.2 34.3,23.2 34.3,37.9 IC4.4
USB_D-
  Bottom 0.254: IC3.3 34.15,39.55 35,38.7 35,38 IC4.3
  Bottom 0.406: R3.2 33.55,21.45 35,22.9 35,37.9 IC4.3
VCC5V  (via drill 0.33, 0.6)
  Top 0.254: v37.5,36.7 v37.5,38.8 37.5,41.7 36.8,42.4 | 36.8,42.4 32.8,42.4 31.8,41.4 31.8,36.2 v31.9,36.1 27.1,36.1 26.2,37 23.7,37 v23.5,37.2 22.4,36.1 v22.4,28.2 | 36.8,42.4 v36.8,47.8 | v93.6,41.7 v93.6,37.2 93.8,37 v93.8,28.1 v93.8,25.8 | v94.3,51.8 94.3,52.1 v91.4,55 | v91.9,69.3 v91.9,63.6 | v43.3,30.9 43.3,28.6 44.4,27.5
  Top 0.61: v52.8,27.7 50.6,27.7 49.8,28.5 45.4,28.5 44.4,27.5 44.4,19.57 IC7.1 | v94.74,55.84 104.56,55.84 106.5,53.9 v140.3,53.9 142.2,53.9 144.4,56.1 148.09,56.1 J2.2 J2.1 | v7.8,27.5 5.7,25.4 5.7,15.3 v6.3,14.7
  Bottom 0.254: 34.65,39.85 35.8,38.7 35.8,38 IC4.2 35.85,36.6 C8.1 36.75,35.95 v37.5,36.7 | 37.9,47.7 37.6,47.7 36.15,46.25 IC3.34 | 37.9,47.7 38.4,47.7 IC4.34 C9.1 | IC3.7 32.15,38.85 31.8,38.5 31.8,38.1 | 31.8,38.1 31.8,36.2 v31.9,36.1 | v22.4,28.2 22.46,28.14 JP1.2 | v36.8,47.8 37.8,47.8 arc-90 37.9,47.7 | v37.5,38.8 37.8,38.8 40.1,36.5 43,36.5 43.3,36.8 | IC4.7 31.85,38.05 31.8,38.1 | IC3.14 28.45,42.25 27.6,41.4 26.9,41.4 IC4.14 24.05,41.35 23.5,40.8 v23.5,37.2 22,35.7 R6.2 | 43.3,36.8 L1.1 | 43.3,36.8 v43.3,30.9 | IC2.24 97.38,28.28 96.9,27.8 94.1,27.8 v93.8,28.1 | v93.6,41.7 93.6,48 94.3,48.7 | 94.3,48.7 97.63,48.7 IC1.24 | C2.1 93.89,37.19 v93.6,37.2 | 94.3,48.7 v94.3,51.8 | v91.4,55 91.3,55.14 91.3,55.84 | C1.1 94.8,55.9 v94.74,55.84 | R18.1 92.5,73.5 91.9,72.9 v91.9,69.3 | v91.9,63.6 91.9,56.34 92.4,55.84 | R19.2 100.6,24 100.1,23.5 96.1,23.5 v93.8,25.8
  Bottom 0.305: 34.65,39.85 IC3.2
  Bottom 0.406: J2.1 152.24,56.14 154,57.9 173.5,57.9 | 173.6,57.9 173.15,57.85 | 173.15,57.85 175.2,55.9 175.2,54 IC5.2 | 173.6,57.9 196.5,57.9 204.3,50.1 204.3,37.4 201.8,34.9 200,34.9 198.53,36.37 JP6.10 | 173.6,57.9 173.5,57.9 | 173.5,57.9 173.15,57.85
  Bottom 0.61: CORE.24 54.29,26.21 v52.8,27.7 52.6,27.9 52.6,52.4 54.1,53.9 | 54.1,53.9 56.04,55.84 91.3,55.84 92.4,55.84 v94.74,55.84 | D5.C 52.28,55.72 54.1,53.9 | JP3.1 8.09,47.6 10.1,47.6 11.5,46.2 11.5,31.2 9.6,29.3 9,29.3 7.8,28.1 v7.8,27.5 | v6.3,14.7 D1.C
  Bottom 0.813: v140.3,53.9 140.3,48.9 139.2,47.8 D4.C
  Bottom 1.27: D1.C 12.9,14.7 17.5,19.3 35.2,19.3 38,22.1 43.6,22.1 44.4,21.3 44.4,19.57 IC7.1
VCC9V  (via drill 0.33, 0.6)
  Top 0.254: v50.3,7.3 48.4,7.3 48.2,7.5 | v101.1,2.8 v101.1,5.3
  Top 0.813: 48.19,26.21 v48.2,26.8 | v136,21 v136,8.4
  Top 1.422: 97.5,5.4 98.8,5.3
  Top 1.676: v48.2,26.8 v48.2,10.3 48.2,7.5 48.2,7 46.5,5.3 | 46.5,5.3 v8.9,5.3 arc90 8.1,6.1 2.9,6.1 arc-90 1.3,7.7 v1.3,48 v1.3,55.1 | 46.5,5.3 98.8,5.3 v101.1,5.3 v105.5,5.3 v107.6,5.3 v136,5.3 178.8,5.3 arc111 JP6.9
  Bottom 0.254: R13.2 4.3,6.6 4.8,6.1 8.6,6.1 8.8,6.3 | R14.2 v50.3,7.3 | R15.2 101,5.4 v101.1,5.3 | R17.2 106.9,2.4 107.6,3.1 v107.6,5.3 | R16.2 101.5,2.4 v101.1,2.8
  Bottom 0.406: T2.2 49.34,11.44 v48.2,10.3 | T3.2 104.56,11.44 | T1.2 7.86,11.34 8.8,10.4 8.8,6.3 8.8,5.4 v8.9,5.3 | C11.1 v136,21
  Bottom 0.61: T5.2 108.24,8.04 107.6,7.4 v107.6,5.3 | T4.2 104.86,7.94 105.3,7.5 | 105.3,7.5 105.5,7.3 v105.5,5.3 | 104.56,11.44 104.76,11.44 105.5,10.7 105.5,7.7 105.3,7.5
  Bottom 0.813: IC6.1 v136,21 | v136,8.4 v136,5.3 | JP3.2 1.72,47.58 v1.3,48
  Bottom 1.676: D2.C v1.3,55.1 | D3.C 47.8,26.4 v48.2,26.8
XTAL1
  Bottom 0.254: IC3.17 IC4.17 23.05,43.75 R5.2 19.7,44.4 18.4,45.7 18.4,48.63 X1.2 18.37,52.52 C4.2
XTAL2
  Bottom 0.254: IC3.16 27.85,43.25 27.6,43 26.9,43 IC4.16 22.75,42.95 R5.1 19.1,42.6 18.4,41.9 18.4,39.03 X1.1 C5.2

## Text on the board
Bottom: Alpha | LED Display | Plover Electric | plover.io/alpha | Rev B 2014 (TAPR OHL)
bPlace: 5V | 5V | GND | GND | D0 | D7 | RX | D1 | D8 | TX | D2 | D9 | SDA | D3 | D10 | SCL | D4 | MOSI | D11 | D5 | D12 | MISO | D6 | SCK | LATCH | A0 | BLANK | A1 | PREZ | A2 | GND
bStop: Alpha | LED Display | Plover Electric | plover.io/alpha | Rev B 2014 (TAPR OHL)